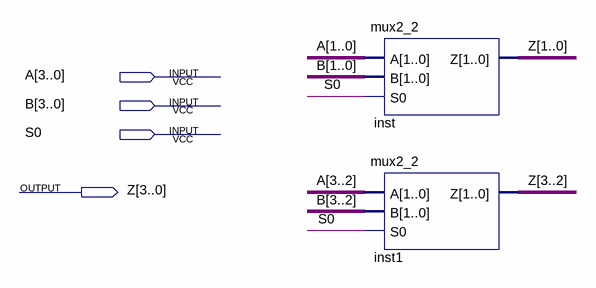
[diagram p0: schematic sheet]
// Quartus schematic mux2_4.bdf as structural Verilog: 2 symbols, 4 pins
module mux2_4 (
  input  [3:0] A,
  input  [3:0] B,
  input  S0,
  output [3:0] Z
);

  mux2_2 inst (.A(A[1:0]), .B(B[1:0]), .S0(S0), .Z(Z[1:0]));
  mux2_2 inst1 (.A(A[3:2]), .B(B[3:2]), .S0(S0), .Z(Z[3:2]));
endmodule
